# Altium schematic sheet Main_schmatics.SchDoc
size A4
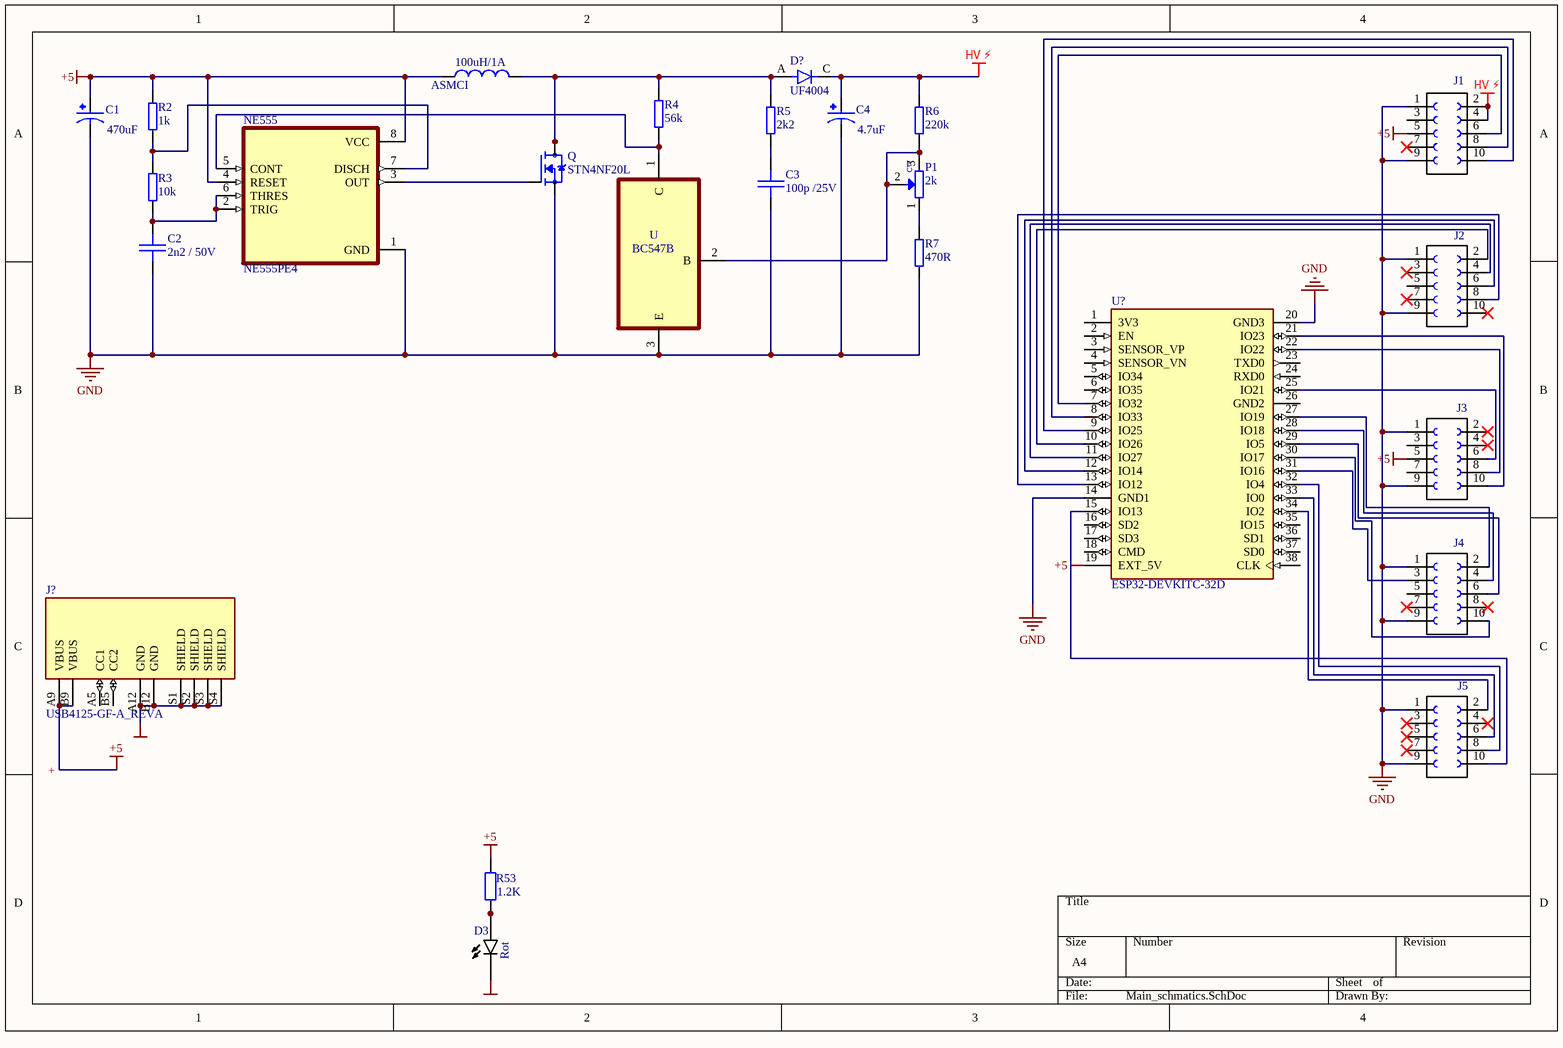
[diagram p0: Main_schmatics.SchDoc]

## Parts
100uH/1A  ASMCI  [PCBComponent_1]
C1  470uF  [CAPPRD500W60D1000H2200]
C2  2n2 / 50V  [C_0805_A]
C3  100p /25V  [C_0402_A]
C4  4.7uF  [CAPPRD500W60D1000H2200]
D3  Rot  [*LEDC3216X110_LTST-C230KFKT(Primary)]
D?  UF4004  [DIOAD1055W87L533D272]
J1  61301021821  [*61301021821]  (value not drawn)
J2  61301021821  [*61301021821]  (value not drawn)
J3  61301021821  [*61301021821]  (value not drawn)
J4  61301021821  [*61301021821]  (value not drawn)
J5  61301021821  [*61301021821]  (value not drawn)
J?  USB4125-GF-A_REVA  [GCT_USB4125-GF-A_REVA]
NE555  NE555PE4  [DIP794W45P254L959H508Q8]
P1  2k  [R_CA6V_SMD]
Q  STN4NF20L  [SOT223]
R2  1k  [R_0805_A]
R3  10k  [R_0805_A]
R4  56k  [R_0805_A]
R5  2k2  [R_0805_A]
R6  220k  [R_0805_A]
R7  470R  [R_0805_A]
R53  value 1.2K  [*CAPC2013X90N]  (hidden comment: Res2)
U  BC547B  [TO127P254X732-3]
U?  ESP32-DEVKITC-32D  [MODULE_ESP32-DEVKITC-32D]

## Nets
+5: 100uH/1A.1 C1.P J1.5 J3.5 J?.A9(VBUS) J?.B9(VBUS) NE555.4(RESET) NE555.8(VCC) R2.2 R53.2 U?.19(EXT_5V)
GND: C1.N C2.1 C3.1 C4.N D3.C J1.1 J1.9 J2.1 J2.9 J3.1 J3.9 J4.1 J4.9 J5.1 J5.9 J?.A12(GND) J?.B12(GND) J?.S1(SHIELD) J?.S2(SHIELD) J?.S3(SHIELD) J?.S4(SHIELD) NE555.1(GND) Q.3(S) R7.1 U.3(E) U?.14(GND1) U?.20(GND3)
HV ⚡: C4.P D?.C(K) J1.2 J1.4 R6.2
Net100uH/1A_2: 100uH/1A.2 D?.A Q.2(D) Q.T(D) R4.2 R5.2
NetC2_2: C2.2 NE555.2(TRIG) NE555.6(THRES) R3.1
NetC3_2: C3.2 R5.1
NetD3_A: D3.A R53.1
NetJ1_6: J1.6 U?.7(IO32)
NetJ1_8: J1.8 U?.8(IO33)
NetJ1_10: J1.10 U?.9(IO25)
NetJ2_2: J2.2 U?.10(IO26)
NetJ2_4: J2.4 U?.11(IO27)
NetJ2_6: J2.6 U?.12(IO14)
NetJ2_8: J2.8 U?.13(IO12)
NetJ3_6: J3.6 U?.25(IO21)
NetJ3_8: J3.8 U?.22(IO22)
NetJ3_10: J3.10 U?.21(IO23)
NetJ4_2: J4.2 U?.27(IO19)
NetJ4_3: J4.3 U?.31(IO16)
NetJ4_4: J4.4 U?.28(IO18)
NetJ4_6: J4.6 U?.29(IO5)
NetJ4_10: J4.10 U?.30(IO17)
NetJ5_2: J5.2 U?.34(IO2)
NetJ5_6: J5.6 U?.33(IO0)
NetJ5_8: J5.8 U?.32(IO4)
NetJ5_10: J5.10 U?.15(IO13)
NetNE555_3: NE555.3(OUT) Q.1(G)
NetNE555_5: NE555.5(CONT) R4.1 U.1(C)
NetNE555_7: NE555.7(DISCH) R2.1 R3.2
NetP1_1: P1.1 R7.2
NetP1_2: P1.2 P1.3 R6.1 U.2(B)

Not connected (* = marked no-connect by the designer): J1 3(2) 7(4)*; J2 3(2)* 5(3) 7(4)* 10(6)*; J3 2(10)* 3(2) 4(9)* 7(4); J4 5(3) 7(4)* 8(7)*; J5 3(2)* 4(9)* 5(3)* 7(4)*; J? A5(CC1) B5(CC2); U? 1(3V3) 2(EN) 3(SENSOR_VP) 4(SENSOR_VN) 5(IO34) 6(IO35) 16(SD2) 17(SD3) 18(CMD) 23(TXD0) 24(RXD0) 26(GND2) 35(IO15) 36(SD1) 37(SD0) 38(CLK)

## Notes on the sheet
- +
- (in symbol 301 472) CW

## Library data of the parts
100uH/1A = ASMCI-0603-R10M-T: Ind Chip Shielded Multi-Layer 100nH 20% 1MHz Ferrite 700mA 0603 T/R; Package: None; Price: None; Value: *; MP: ASMCI-0603-R10M-T; Availability: Unavailable
C1 C4 = UPM1E471MPD1TD: PM Series 470 uF 25 V 105Â°C Ã˜10 x 20 mm LS=5 mm Radial Aluminum Electrolytic Cap; MF: Nichicon; Purchase-URL: https://pricing.snapeda.com/search/part/UPM1E471MPD1TD/?ref=eda; Price: None; SnapEDA_Link: https://www.snapeda.com/parts/UPM1E471MPD1TD/Nichicon/view-part/2321207/?ref=snap; Check_prices: https://www.snapeda.com/parts/UPM1E471MPD1TD/Nichicon/view-part/2321207/?ref=eda; Package: Radial Nichicon; Availability: Good; Value: *; MP: UPM1E471MPD1TD
C2 = 300 129: C 2n2 10% 50V X7R 0805; Part Number: 300 129; %: 10; Signal Integrity: Cap; Imax: x; C2: 1; C3: 4; Ea1: 0.35; Tref: 40; State: active; Assembly: SMD; UrefUmax: 0.5; VALUE: 2n2 / 50V; Umax: 50V; Component Type: Capacitor; ComponentLink1Description: Datasheet; ComponentLink1URL: \\vm-pizol\DATEN\Fabdaten\3xx xxx\30x xxx\300 xxx\300 1xx\300129_C_2.2nF_10%_50V_X7R_0805; Footprint: 0805; Pin Count: 2; Published: 08.01.2016; Publisher: RKE; Ieff: x; Ueff: *; Teff: *; C1: x; A: 1; Ea2: x; Failure rate: 2; Cost: 0.004800; Pmax: x; IrefImax: x
C3 = 301 048: C 100p 5% 25V C0G 0402; Part Number: 301 048; %: 5; Signal Integrity: Cap; Imax: x; C2: 1; C3: 4; Ea1: 0.35; Tref: 40; State: active; Assembly: SMD; UrefUmax: 0.5; VALUE: 100p /25V; Umax: 25V; Component Type: Capacitor; ComponentLink1Description: Datasheet; ComponentLink1URL: \\vm-pizol\DATEN\Fabdaten\3xx xxx\30x xxx\301 xxx\301 0xx\301048_C_100pF_5%_25V_COG_0402; Footprint: 0402; Pin Count: 2; Published: 08.01.2016; Publisher: RKE; Ieff: x; Ueff: *; Teff: *; C1: x; A: 1; Ea2: x; Failure rate: 1; Cost: 0.001200; Pmax: x; IrefImax: x
D3 = LTST-C230KFKT: LED; SMD; 1206; orange; 45-90mcd; 3.2x1.6x1.1mm; 130Â°; 2Ã·2.4V; 20mA; MF: Lite-On Inc.; MP: LTST-C230KFKT; SnapEDA_Link: https://www.snapeda.com/parts/LTST-C230KFKT/Lite-On%20Inc./view-part/?ref=snap; Availability: Unavailable; Package: 1206 Lite-On; Price: None; Value: *
D? = UF4004: Diode Standard 400V 1A Through Hole DO-204AL (DO-41); MF: ON Semiconductor; Purchase-URL: https://pricing.snapeda.com/search/part/UF4004/?ref=eda; Price: None; MP: UF4004; Value: *; Availability: Good; SnapEDA_Link: https://www.snapeda.com/parts/UF4004/ON%20Semiconductor/view-part/1592468/?ref=snap; Package: DO-41-2 ON Semiconductor
J1-J5 = 61301021821: Female header [WÃ¼rth Elektronik] 61301021821 Female header; MF: Wurth Electronics; Digi-Key_Purchase_URL: https://www.digikey.ch/product-detail/en/wurth-electronics-inc/61301021821/732-2861-ND/2508630?utm_source=snapeda&utm_medium=aggregator&utm_campaign=symbol; Digi-Key_Part_Number: 732-2861-ND; SnapEDA_Link: https://www.snapeda.com/parts/61301021821/Wurth%20Electronics%20Inc./view-part/?ref=snap; MP: 61301021821; Package: None; Value: *
J? = USB4125-GF-A_REVA: USB 2.0 Type C Receptacle, Horizontal, SMT, For Power charging; MF: Global Connector Technology; SnapEDA_Link: https://www.snapeda.com/parts/USB4125-GF-A/Global%20Connector%20Technology/view-part/5160675/?ref=snap; Package: None; Check_prices: https://www.snapeda.com/parts/USB4125-GF-A/Global%20Connector%20Technology/view-part/5160675/?ref=eda; MP: USB4125-GF-A; Value: *; Availability: Unavailable; Price: None
NE555 = NE555PE4: Single Precision Timer 8-PDIP 0 to 70; MF: Texas Instruments; Package: PDIP-8 Texas Instruments; Availability: Warning; Texas_Instruments-Purchase-URL: https://snapeda.com/shop?store=Texas+Instruments&id=5082; MP: NE555PE4; Value: *; SnapEDA_Link: https://www.snapeda.com/parts/NE555PE4/Texas%20Instruments/view-part/5082/?ref=snap; Price: None; Mouser-Purchase-URL: https://snapeda.com/shop?store=Mouser&id=5082
P1 = 301 472: R 2k 25% 100mW Trimmer lin 6.5x6.5; Part Number: 301 472; %: 25; Signal Integrity: Resistor; Umax: 100V; Imax: x; A: 0.87; Ea1: 0.16; Ea2: 0.44; Tref: 55; Pmax: 0.100; State: active; Assembly: SMD; VALUE: 2k; LatestRevisionDate: 30.06.2016/RKE; Component Type: Resistor; ComponentLink1Description: Datasheet; ComponentLink1URL: \\vm-pizol\DATEN\Fabdaten\3xx xxx\30x xxx\301 xxx\301 4xx\301472_R_2K_25%_Trimmpoti_CA6V_lin; Footprint: Poti; Pin Count: 3; Published: 29.04.2016; Publisher: MFL; Cost: 0.120300; Ieff: x; Ueff: x; Teff: *; SW Count: x; C1: x; C2: x; C3: x; C4: x; C5: x; Failure rate: 30; Uref: x; UrefUmax: x; IrefImax: x
Q = STN4NF20L: N-Channel 200V 1A _Tc_ 3.3W _Tc_ Surface Mount SOT-223; MF: STMicroelectronics; SnapEDA_Link: https://www.snapeda.com/parts/STN4NF20L/STMicroelectronics/view-part/106602/?ref=snap; Availability: Unavailable; MP: STN4NF20L; Package: SOT-223 STMicroelectronics; Price: None; Value: *
R2 = 300 074: R 1k 1% 125mW 0805; Part Number: 300 074; %: 1; Imax: x; A: 0.87; Ea1: 0.16; Ea2: 0.44; Tref: 55; Pmax: 0.125; State: active; Assembly: SMD; VALUE: 1k; Component Type: Resistor; ComponentLink1Description: Datasheet; ComponentLink1URL: \\vm-pizol\DATEN\Fabdaten\3xx xxx\30x xxx\300 xxx\300 0xx\300074_R_1K_5%_125mW_0805; Footprint: 0805; Pin Count: 2; Published: 27.04.2016; Publisher: MFL; Signal Integrity: Resistor; Cost: 0.002000; Umax: *; Ieff: x; Ueff: x; Teff: *; SW Count: x; C1: x; C2: x; C3: x; C4: x; C5: x; Failure rate: 0.2; Uref: x; UrefUmax: x; IrefImax: x
R3 = 300 080: R 10k 1% 125mW 0805; Part Number: 300 080; %: 1; Imax: x; A: 0.87; Ea1: 0.16; Ea2: 0.44; Tref: 55; Pmax: 0.125; State: active; Assembly: SMD; VALUE: 10k; Component Type: Resistor; ComponentLink1Description: Datasheet; ComponentLink1URL: \\vm-pizol\DATEN\Fabdaten\3xx xxx\30x xxx\300 xxx\300 0xx\300080_R_10K_1%_125mW_0805; Footprint: 0805; Pin Count: 2; Published: 27.04.2016; Publisher: MFL; Signal Integrity: Resistor; Cost: 0.002000; Umax: *; Ieff: x; Ueff: x; Teff: *; SW Count: x; C1: x; C2: x; C3: x; C4: x; C5: x; Failure rate: 0.2; Uref: x; UrefUmax: x; IrefImax: x
R4 = 302 780: R 56k 1% 125mW 0805; Part Number: 302 780; %: 1; Imax: x; A: 0.87; Ea1: 0.16; Ea2: 0.44; Tref: 55; Pmax: 0.125; State: active; Assembly: SMD; VALUE: 56k; Component Type: Resistor; ComponentLink1Description: Datasheet; ComponentLink1URL: \\vm-pizol\DATEN\Fabdaten\3xx xxx\30x xxx\302 xxx\302 7xx\302780; Footprint: 0805; Pin Count: 2; Published: 28.04.2016; Publisher: MFL; Signal Integrity: Resistor; Cost: 0.003200; Umax: *; Ieff: x; Ueff: x; Teff: *; SW Count: x; C1: x; C2: x; C3: x; C4: x; C5: x; Failure rate: 0.2; Uref: x; UrefUmax: x; IrefImax: x
R5 = 300 848: R 2k2 5% 125mW 0805; Part Number: 300 848; %: 5; Imax: x; A: 0.87; Ea1: 0.16; Ea2: 0.44; Tref: 55; Pmax: 0.125; State: active; Assembly: SMD; VALUE: 2k2; Component Type: Resistor; ComponentLink1Description: Datasheet; ComponentLink1URL: \\vm-pizol\DATEN\Fabdaten\3xx xxx\30x xxx\300 xxx\300 8xx\300848_R_2K2_5%_125mW_0805; Footprint: 0805; Pin Count: 2; Published: 28.04.2016; Publisher: MFL; Signal Integrity: Resistor; Cost: 0.002000; Umax: *; Ieff: x; Ueff: x; Teff: *; SW Count: x; C1: x; C2: x; C3: x; C4: x; C5: x; Failure rate: 0.2; Uref: x; UrefUmax: x; IrefImax: x
R6 = 300 089: R 220k 5% 125mW 0805; Part Number: 300 089; %: 5; Imax: x; A: 0.87; Ea1: 0.16; Ea2: 0.44; Tref: 55; Pmax: 0.125; State: active; Assembly: SMD; VALUE: 220k; Component Type: Resistor; ComponentLink1Description: Datasheet; ComponentLink1URL: \\vm-pizol\DATEN\Fabdaten\3xx xxx\30x xxx\300 xxx\300 0xx\300089_R_220K_5%_125mW_0805; Footprint: 0805; Pin Count: 2; Published: 28.04.2016; Publisher: MFL; Signal Integrity: Resistor; Cost: 0.002000; Umax: *; Ieff: x; Ueff: x; Teff: *; SW Count: x; C1: x; C2: x; C3: x; C4: x; C5: x; Failure rate: 0.2; Uref: x; UrefUmax: x; IrefImax: x
R7 = 300 073: R 470R 5% 125mW 0805; Part Number: 300 073; %: 5; Imax: x; A: 0.87; Ea1: 0.16; Ea2: 0.44; Tref: 55; Pmax: 0.125; State: active; Assembly: SMD; VALUE: 470R; Component Type: Resistor; ComponentLink1Description: Datasheet; ComponentLink1URL: \\vm-pizol\DATEN\Fabdaten\3xx xxx\30x xxx\300 xxx\300 0xx\300073_R_470R_5%_125mW_0805; Footprint: 0805; Pin Count: 2; Published: 27.04.2016; Publisher: MFL; Signal Integrity: Resistor; Cost: 0.001900; Umax: *; Ieff: x; Ueff: x; Teff: *; SW Count: x; C1: x; C2: x; C3: x; C4: x; C5: x; Failure rate: 0.2; Uref: x; UrefUmax: x; IrefImax: x
R53 = Res2: Resistor; Published: 8-Jun-2000; LatestRevisionDate: 17-Jul-2002; LatestRevisionNote: Re-released for DXP Platform.; PackageReference: AXIAL-0.4; Publisher: Altium Limited; PackageDescription: Axial Device, Thru-Hole; 2 Leads; 0.4 in Pin Spacing
U = BC547B: Bipolar _BJT_ Transistor NPN 45V 100mA 300MHz 500mW Through Hole TO-92-3; MF: ON Semiconductor; Package: TO-226-3 ITT / Cannon; Value: *; Price: None; MP: BC547B; Availability: Unavailable; SnapEDA_Link: https://www.snapeda.com/parts/BC547B/ON%20Semiconductor/view-part/2777874/?ref=snap
U? = ESP32-DEVKITC-32D: EVAL BOARD FOR ESP-WROOM-32; MF: Espressif Systems; Value: *; MP: ESP32-DEVKITC-32D; Price: None; Check_prices: https://www.snapeda.com/parts/ESP32-DEVKITC-32D/Espressif%20Systems/view-part/2777395/?ref=eda; SnapEDA_Link: https://www.snapeda.com/parts/ESP32-DEVKITC-32D/Espressif%20Systems/view-part/2777395/?ref=snap; Availability: Warning; Purchase-URL: https://pricing.snapeda.com/search/part/ESP32-DEVKITC-32D/?ref=eda; Package: None